# Altium schematic sheet Power.SchDoc
size A3; Author: Danius Kalvaitis; Organization: Altium Limited; Address1: L3, 12a Rodborough Rd; Address2: Frenchs Forest; Address3: NSW; Address4: Australia 2086; DocumentNumber: 5; SheetNumber: 5; SheetTotal: 9
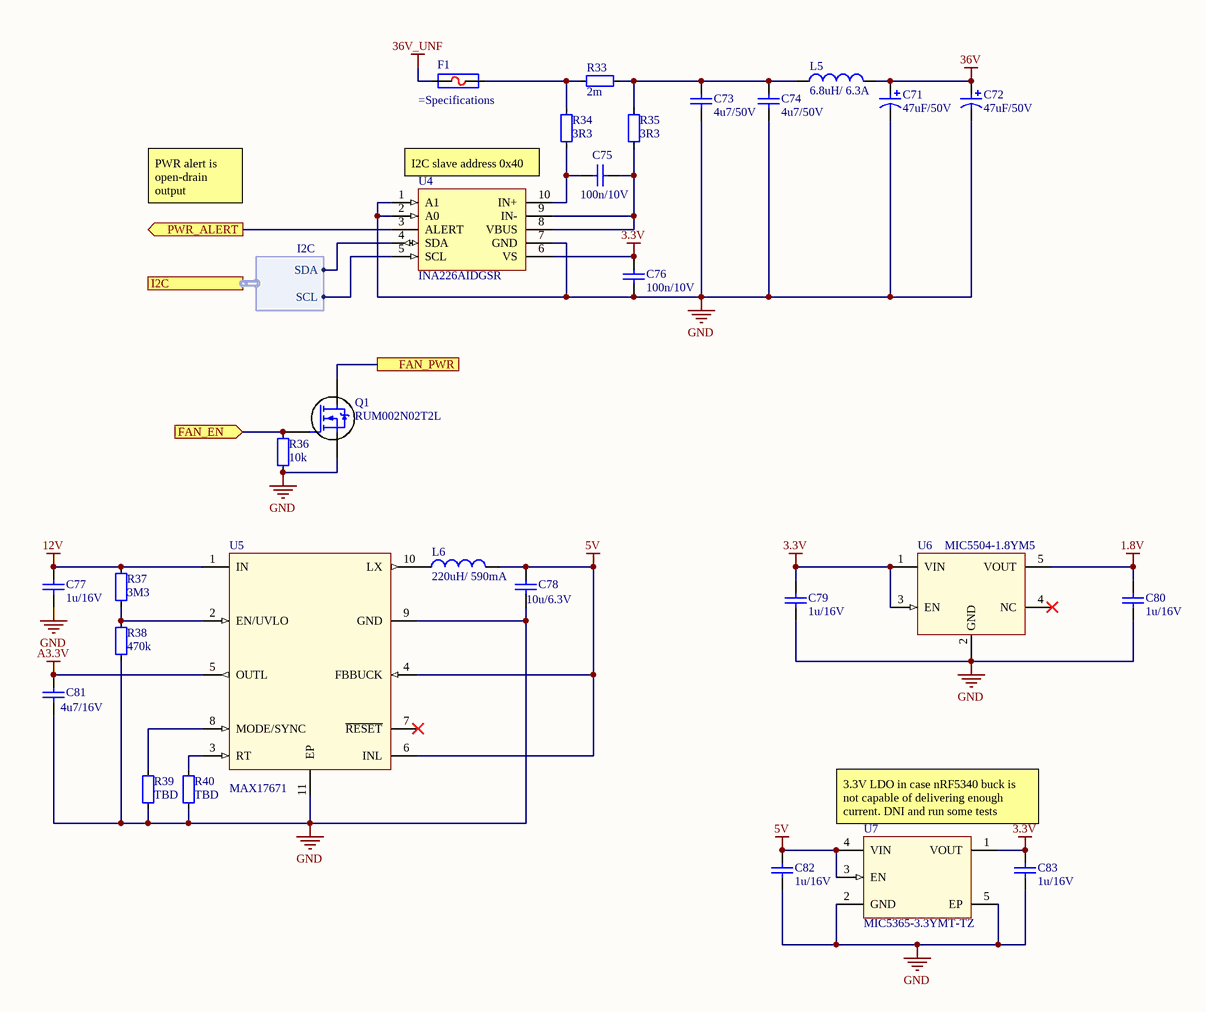
[diagram p0: Power.SchDoc]

## Parts
C71  47uF/50V  [WURTH-L6.5-D8]
C72  47uF/50V  [WURTH-L6.5-D8]
C73  4u7/50V  [C1210]
C74  4u7/50V  [C1210]
C75  100n/10V  [C0402]
C76  100n/10V  [C0402]
C77  1u/16V  [C0603]
C78  10u/6.3V  [C0805]
C79  1u/16V  [C0603]
C80  1u/16V  [C0603]
C81  4u7/16V  [C0805]
C82  1u/16V  [C0603]
C83  1u/16V  [C0603]
F1  (no value)  [F2512]
L5  6.8uH/ 6.3A  [SRR1260]
L6  220uH/ 590mA  [TYS6045221M-10]
Q1  RUM002N02T2L  [SOT-723-3]
R33  2m  [R1206]
R34  3R3  [R0402]
R35  3R3  [R0402]
R36  10k  [R0402]
R37  3M3  [R0402]
R38  470k  [R0402]
R39  TBD  [R0402]
R40  TBD  [R0402]
U4  INA226AIDGSR  [MSOP-10]
U5  MAX17671  [TDFN-10]
U6  MIC5504-1.8YM5  [SOT23-5]
U7  MIC5365-3.3YMT-TZ  [MLF-4]

## Ports
FAN_EN (in), FAN_PWR, I2C (harness I2C), PWR_ALERT (out)

## Harnesses
I2C: SCL, SDA

## Nets
1.8V: C80.2 U6.5(VOUT)
3.3V: C76.2 C79.2 C83.2 U4.6(VS) U6.1(VIN) U6.3(EN) U7.1(VOUT)
5V: C78.2 C82.2 L6.2 U5.4(FBBUCK) U5.6(INL) U7.3(EN) U7.4(VIN)
12V: C77.2 R37.2 U5.1(IN)
36V: C71.1 C72.1 L5.2
36V_UNF: F1.1
A3.3V: C81.2 U5.5(OUTL)
GND: C71.2 C72.2 C73.1 C74.1 C76.1 C77.1 C78.1 C79.1 C80.1 C81.1 C82.1 C83.1 Q1.2(S) R36.1 R38.1 R39.1 R40.1 U4.1(A1) U4.2(A0) U4.7(GND) U5.9(GND) U5.11(EP) U6.2(GND) U7.2(GND) U7.5(EP)
FAN_EN: Q1.1(G) R36.2 ; port FAN_EN
FAN_PWR: Q1.3(D) ; port FAN_PWR
PWR_ALERT: U4.3(ALERT) ; port PWR_ALERT
NetC73_2: C73.2 C74.2 L5.1 R33.2 R35.2
NetC75_1: C75.1 R34.1 U4.10(IN+)
NetC75_2: C75.2 R35.1 U4.8(VBUS) U4.9(IN-)
NetF1_2: F1.2 R33.1 R34.2
NetL6_1: L6.1 U5.10(LX)
NetR37_1: R37.1 R38.2 U5.2(EN/UVLO)
NetR39_2: R39.2 U5.8(MODE/SYNC)
NetR40_2: R40.2 U5.3(RT)
NetU4_4: U4.4(SDA) ; port I2C.SDA
NetU4_5: U4.5(SCL) ; port I2C.SCL

Not connected (* = marked no-connect by the designer): U5 7(~{RESET})*; U6 4(NC)*

## Notes on the sheet
- I2C slave address 0x40
- PWR alert is open-drain output
- 3.3V LDO in case nRF5340 buck is not capable of delivering enough current. DNI and run some tests
- Title
- Date:
- Number:
- Revision:
- Sheet
- of
- File:
- Author

## Library data of the parts
C71 C72 = Wurth-47uF-50V-L6.5-D8: Aluminium Electrolytic Capacitors - SMD WCAP-ASLI 50V 47uF 20% ESR=690mOhms; Manufacturer Part Number 1: 865080649013; Manufacturer 1: Wurth Elektronik; Specifications: 47uF 50V ±20%; ComponentLink1Description: Datasheet; ComponentLink1URL: https://www.mouser.co.uk/datasheet/2/445/865080649013-1075240.pdf; Capacitance: 47uF; Voltage: 50V; Tolerance: 20%; Supplier 1: Mouser; Supplier Part Number 1: 710-865080649013
C73 C74 = 4u7 50V X7R 1210: Manufacturer Part Number 1: UMK325B7475KMHP; Manufacturer 1: Taiyo Yuden; Voltage: 50V; Tolerance: 10%; Specifications: X7R 4u7 50V ±10%; Capacitance: 4u7; Dielectric: X7R; Supplier 1: Mouser; Supplier Part Number 1: 963-UMK325B7475KMHP
C75 C76 = 100n 10V X5R 0402: Manufacturer Part Number 1: 885012105010; Manufacturer 1: Wurth Elektronik; Voltage: 10V; Tolerance: 20%; Specifications: X5R 100n 10V ±20%; Capacitance: 100n; Dielectric: X5R; Supplier 1: Mouser; Supplier Part Number 1: 710-885012105010
C77 C79 C80 C82 C83 = 1u 16V X7R 0603: Manufacturer Part Number 1: 885012206052; Manufacturer 1: Wurth Elektronik; Voltage: 16V; Tolerance: 10%; Specifications: X7R 1u 16V ±10%; Capacitance: 1u; Dielectric: X7R; Supplier 1: Mouser; Supplier Part Number 1: 710-885012206052
C78 = 10u 6V3 X7R 0805: Manufacturer Part Number 1: JMK212B7106KG-T; Manufacturer 1: Taiyo Yuden; Voltage: 6.3V; Tolerance: 10%; Specifications: X7R 10u 6.3V ±10%; Capacitance: 10u; Dielectric: X7R; Supplier 1: Mouser; Supplier Part Number 1: 963-JMK212B7106KG-T
C81 = 4u7 16V X7R 0805: Manufacturer Part Number 1: EMK212AB7475KGHT; Manufacturer 1: Taiyo Yuden; Voltage: 16V; Tolerance: 10%; Specifications: X7R 4u7 16V ±10%; Capacitance: 4u7; Dielectric: X7R; Supplier 1: Mouser; Supplier Part Number 1: 963-EMK212AB7475KGHT
F1 = 0451005.NRL: Surface Mount Fuses 125VAC 5A .0125ohms 451 NANO2; Manufacturer 1: Littlefuse; Specifications: Fast Blow 5A 125VDC; Voltage Rating: 125VDC; Fuse Type: Fast Blow; Current Rating: 5A; ComponentLink1Description: Datasheet; ComponentLink1URL: https://www.mouser.co.uk/datasheet/2/240/Littelfuse_Fuse_451_453_Datasheet_pdf-468354.pdf; Supplier 1: Mouser; Supplier Part Number 1: 576-0451005.NRL; Manufacturer Part Number 1: 0451005.NRL
L5 = SRR1260-6R8Y: Fixed Inductors 6.8uH 30% SMD 1260; Manufacturer 1: Bourns; Specifications: 6.8uH 6.3A 30%; ComponentLink1Description: Datasheet; ComponentLink1URL: https://www.mouser.co.uk/datasheet/2/54/rr1260-1391580.pdf; Inductance: 6.8uH; Tolerance: 30%; Current: 6.3A; Manufacturer Part Number: SRR1260-6R8Y; Supplier 1: Mouser; Supplier Part Number 1: 652-SRR1260-6R8Y; Manufacturer Part Number 1: SRR1260-6R8Y
L6 = TYS6045221M-10: Fixed Inductors 220uH 20% -40C +125C; Specifications: 220uH 590mA 20%; ComponentLink1Description: Datasheet; ComponentLink1URL: https://assets.lairdtech.com/home/brandworld/files/TYS6045221M-10.pdf; Current: 590mA; Inductance: 220uH; Manufacturer Part Number: TYS6045221M-10; Tolerance: 20%; Supplier 1: Mouser; Supplier Part Number 1: 875-TYS6045221M-10
Q1 = RUM002N02T2L: N-Channel 20V 200mA (Ta) 150mW (Ta) Surface Mount VMT3; Manufacturer 1: ROHM Semiconductor; On Resistance: 1.2Ohm; VGS: 2.5V; Specifications: N-Channel 200mA 2.5V; ComponentLink1Description: Datasheet; ComponentLink1URL: https://d1d2qsbl8m0m72.cloudfront.net/en/products/databook/datasheet/discrete/transistor/mosfet/rum002n02t2l-e.pdf; Supplier 1: Farnell; Supplier Part Number 1: 2706688; Manufacturer Part Number 1: RUM002N02T2L; Transistor Polarity: N-Channel; VDS: 20V; Drain Current: 200mA; Price @ 10k: 0.043
R33 = 2m 1W 100V 1206: Current Sense Resistors - SMD 1W 0.002 OHMS 1%; Manufacturer Part Number 1: PCS1206FR0020ET; Manufacturer 1: Ohmite; Voltage: 100V; Power Rating: 1W; Tolerance: 1%; Resistance: 2m; Specifications: =Resistance+ ' '+"Power Rating "+Voltage+' ±'+Tolerance; Supplier 1: Mouser; Supplier Part Number 1: 588-PCS1206FR0020ET
R34 R35 = 3R3 100mW 50V 0402: Manufacturer Part Number 1: RK73H1ETTP3R30F; Manufacturer 1: KOA Speer; Power Rating: 100mW; Tolerance: 1%; Voltage: 50V; Resistance: 3R3; Specifications: =Resistance+ ' '+"Power Rating "+Voltage+' ±'+Tolerance; Supplier 1: Mouser; Supplier Part Number 1: 660-RK73H1ETTP3R30F
R36 = 10k 63mW 50V 0402: Manufacturer Part Number 1: AC0402FR-0710KL; Manufacturer 1: Yageo; Power Rating: 63mW; Tolerance: 1%; Voltage: 50V; Resistance: 10k; Specifications: =Resistance+ ' '+"Power Rating "+Voltage+' ±'+Tolerance; Supplier 1: Mouser; Supplier Part Number 1: 603-AC0402FR-0710KL
R37 = 3M3 63mW 50V 0402: Manufacturer Part Number 1: RC0402FR-073M3L; Manufacturer 1: Yageo; Power Rating: 63mW; Tolerance: 1%; Voltage: 50V; Resistance: 3M3; Specifications: =Resistance+ ' '+"Power Rating "+Voltage+' ±'+Tolerance; Supplier 1: Mouser; Supplier Part Number 1: 603-RC0402FR-073M3L
R38 = 470k 63mW 50V 0402: Manufacturer Part Number 1: CRCW0402470KFKEDC; Manufacturer 1: Vishay; Power Rating: 63mW; Tolerance: 1%; Voltage: 50V; Resistance: 470k; Specifications: =Resistance+ ' '+"Power Rating "+Voltage+' ±'+Tolerance; Supplier 1: Mouser; Supplier Part Number 1: 71-CRCW0402470KFKEDC
R39 R40 = R TBD 0402: Power Rating: ?W; Tolerance: ?%; Voltage: ?V; Resistance: TBD; Specifications: =Resistance+ ' '+"Power Rating "+Voltage+' ±'+Tolerance; Manufacturer Part Number 1: *; Supplier 1: *; Supplier Part Number 1: *; Manufacturer 1: *
U4 = INA226AIDGSR: Current & Power Monitors & Regulators Hi-Side Msmt,Bi-Dir Current/Pwr Mon; Manufacturer 1: Texas Instruments; Manufacturer Part Number 1: INA226AIDGSR; ComponentLink1Description: Datasheet; ComponentLink1URL: https://www.ti.com/lit/ds/symlink/ina226.pdf?ts=1603639828140&ref_url=https%253A%252F%252Fwww.google.com%252F; Supplier 1: Mouser; Supplier Part Number 1: 595-INA226AIDGSR; Supplier 2: Ebay; Supplier Part Number 2: https://www.ebay.com/itm/292413947140?hash=item44153abd04:g:KkcAAOSwup1bzJJs&amdata=enc%3AAQAHAAAA4PdI6VXDLYAPJFEXmHZi1ThRRON26MnYbdmjJKT%2F0dK%2F7GWelxmov%2FVYVmcGdieuIJzLqoO%2BD%2BHoggpZhgSPH2ZVvivlAlKuwXud9ILDOUiWmm8vxYRrJ9Jz0bi6RVpucmt8w%2BX2ZyMTawRkpNpetfg6BauLy6FlRyyJmdkYQj6gMVZhbwIoMXc2muNY31f1spp9JTpkgCNr%2FzVU18zPTNn%2Bsj68HkPpNiej54P62RECWmDMvztQzE4azF%2BaI%2FZmXqVSyvKASGqyPNlrq8T800cfpcDTEwQMdI6ngCFQHQZh%7Ctkp%3ABFBM_u7FtONg
U5 = MAX17671: Switching Voltage Regulators 4.5V - 60V, 150mA Synchronous DC-DC and 5V, 50mA low noise LDO; Manufacturer Part Number: MAX17671FATB+; Manufacturer 1: Maxim; Supplier 1: Mouser; Supplier Part Number 1: 700-MAX17671FATB+; ComponentLink1Description: Datasheet; ComponentLink1URL: https://www.mouser.co.uk/datasheet/2/256/MAX17671-1395932.pdf; Manufacturer Part Number 1: MAX17671FATB+
U6 = MIC5504-1.8YM5: LDO Voltage Regulators Single 300mA LDO with Enable Pull-Down & Auto Discharge; Manufacturer Part Number: MIC5504-1.8YM5-TR; Manufacturer 1: Microchip; ComponentLink1Description: Datasheet; ComponentLink1URL: https://www.mouser.co.uk/datasheet/2/268/MIC550X-1082389.pdf; Supplier 1: Mouser; Supplier Part Number 1: 998-MIC5504-1.8YM5TR; Manufacturer Part Number 1: MIC5504-1.8YM5-TR
U7 = MIC5365-3.3YMT-TZ: LDO Voltage Regulators Ultra Small Single 150mA LDO; Manufacturer 1: Microchip Technology / Atmel; Manufacturer Part Number 1: MIC5365-3.3YMT-TZ; ComponentLink1Description: Datasheet; ComponentLink1URL: https://eu.mouser.com/datasheet/2/268/mic5365-1082359.pdf; Supplier 1: Mouser; Supplier Part Number 1: 998-MIC5365-3.3YMTTZ